# Altium schematic sheet MCU_MSP430F5529IPN.SchDoc
size A4
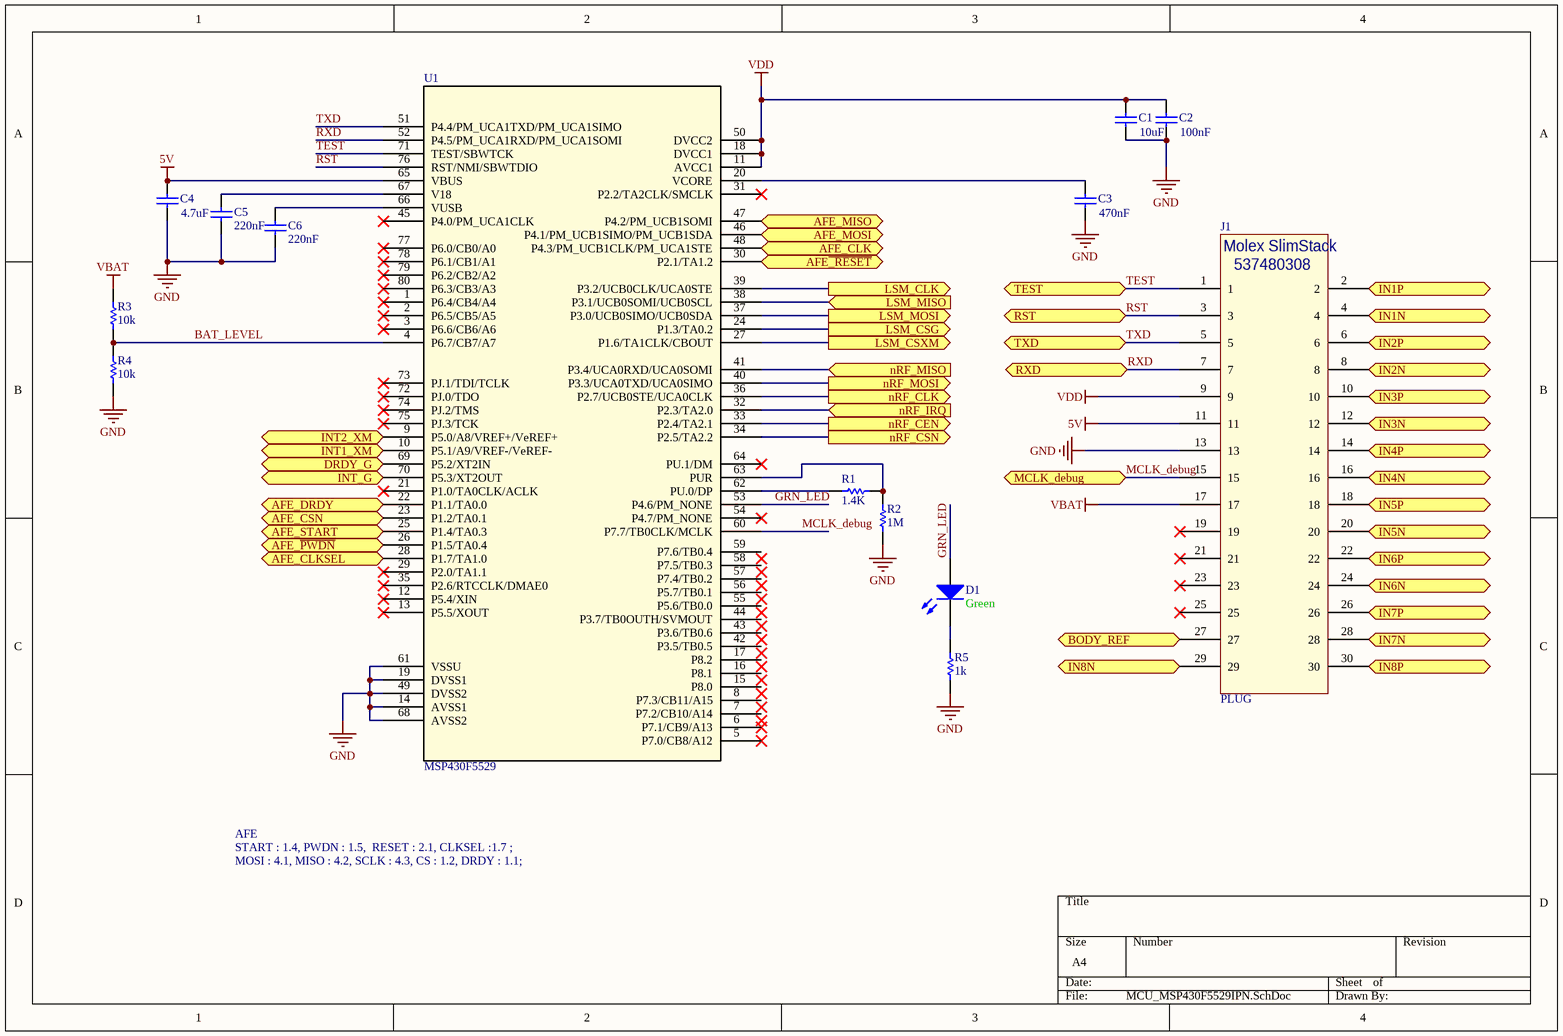
[diagram p0: MCU_MSP430F5529IPN.SchDoc]

## Parts
C1  value 10uF  [0402]  (hidden comment: Cap Semi)
C2  value 100nF  [0402]  (hidden comment: Cap Semi)
C3  value 470nF  [0402]  (hidden comment: Cap Semi)
C4  value 4.7uF  [0402]  (hidden comment: Cap Semi)
C5  value 220nF  [0402]  (hidden comment: Cap Semi)
C6  value 220nF  [0402]  (hidden comment: Cap Semi)
D1  Color: Green  [0402]
J1  PLUG  [Molex 0529910308]
R1  value 1.4K  [0402]
R2  value 1M  [0402]
R3  value 10k  [0402]
R4  value 10k  [0402]
R5  value 1k  [0402]
U1  MSP430F5529  [80-LQFP]

## Ports
AFE_CLK (out), AFE_CLKSEL (out), AFE_CSN (out), AFE_DRDY (in), AFE_MISO (in), AFE_MOSI (out), AFE_START (out), AFE_~{PWDN} (out), AFE~{_RESET} (out), BODY_REF (bidir), DRDY_G (in), IN1N (bidir), IN1P (bidir), IN2N (bidir), IN2P (bidir), IN3N (bidir), IN3P (bidir), IN4N (bidir), IN4P (bidir), IN5N (bidir), IN5P (bidir), IN6N (bidir), IN6P (bidir), IN7N (bidir), IN7P (bidir), IN8N (bidir), IN8P (bidir), INT1_XM (in), INT2_XM (in), INT_G (in), LSM_CLK (out), LSM_CSG (out), LSM_CSXM (out), LSM_MISO (in), LSM_MOSI (out), MCLK_debug (bidir), nRF_CEN (out), nRF_CLK (out), nRF_CSN (out), nRF_IRQ (in), nRF_MISO (in), nRF_MOSI (out), RST (bidir), RXD (bidir), TEST (bidir), TXD (bidir)

## Nets
5V: C4.1 J1.11 U1.65(VBUS)
GND: C1.2 C2.2 C3.2 C4.2 C5.1 C6.1 J1.13 R2.2 R4.1 R5.2 U1.14(AVSS1) U1.19(DVSS1) U1.49(DVSS2) U1.61(VSSU) U1.68(AVSS2)
VBAT: J1.17 R3.2
VDD: C1.1 C2.1 J1.9 U1.11(AVCC1) U1.18(DVCC1) U1.50(DVCC2)
AFE~{_RESET}: U1.30(P2.1/TA1.2) ; port AFE~{_RESET}
AFE_CLK: U1.48(P4.3/PM_UCB1CLK/PM_UCA1STE) ; port AFE_CLK
AFE_CLKSEL: U1.28(P1.7/TA1.0) ; port AFE_CLKSEL
AFE_CSN: U1.23(P1.2/TA0.1) ; port AFE_CSN
AFE_DRDY: U1.22(P1.1/TA0.0) ; port AFE_DRDY
AFE_MISO: U1.47(P4.2/PM_UCB1SOMI) ; port AFE_MISO
AFE_MOSI: U1.46(P4.1/PM_UCB1SIMO/PM_UCB1SDA) ; port AFE_MOSI
AFE_~{PWDN}: U1.26(P1.5/TA0.4) ; port AFE_~{PWDN}
AFE_START: U1.25(P1.4/TA0.3) ; port AFE_START
BAT_LEVEL: R3.1 R4.2 U1.4(P6.7/CB7/A7)
BODY_REF: J1.27 ; port BODY_REF
DRDY_G: U1.69(P5.2/XT2IN) ; port DRDY_G
GRN_LED: D1.1(A) U1.53(P4.6/PM_NONE)
IN1N: J1.4 ; port IN1N
IN1P: J1.2 ; port IN1P
IN2N: J1.8 ; port IN2N
IN2P: J1.6 ; port IN2P
IN3N: J1.12 ; port IN3N
IN3P: J1.10 ; port IN3P
IN4N: J1.16 ; port IN4N
IN4P: J1.14 ; port IN4P
IN5N: J1.20 ; port IN5N
IN5P: J1.18 ; port IN5P
IN6N: J1.24 ; port IN6N
IN6P: J1.22 ; port IN6P
IN7N: J1.28 ; port IN7N
IN7P: J1.26 ; port IN7P
IN8N: J1.29 ; port IN8N
IN8P: J1.30 ; port IN8P
INT1_XM: U1.10(P5.1/A9/VREF-/VeREF-) ; port INT1_XM
INT2_XM: U1.9(P5.0/A8/VREF+/VeREF+) ; port INT2_XM
INT_G: U1.70(P5.3/XT2OUT) ; port INT_G
LSM_CLK: U1.39(P3.2/UCB0CLK/UCA0STE) ; port LSM_CLK
LSM_CSG: U1.24(P1.3/TA0.2) ; port LSM_CSG
LSM_CSXM: U1.27(P1.6/TA1CLK/CBOUT) ; port LSM_CSXM
LSM_MISO: U1.38(P3.1/UCB0SOMI/UCB0SCL) ; port LSM_MISO
LSM_MOSI: U1.37(P3.0/UCB0SIMO/UCB0SDA) ; port LSM_MOSI
MCLK_debug: J1.15 U1.60(P7.7/TB0CLK/MCLK) ; port MCLK_debug
nRF_CEN: U1.33(P2.4/TA2.1) ; port nRF_CEN
nRF_CLK: U1.36(P2.7/UCB0STE/UCA0CLK) ; port nRF_CLK
nRF_CSN: U1.34(P2.5/TA2.2) ; port nRF_CSN
nRF_IRQ: U1.32(P2.3/TA2.0) ; port nRF_IRQ
nRF_MISO: U1.41(P3.4/UCA0RXD/UCA0SOMI) ; port nRF_MISO
nRF_MOSI: U1.40(P3.3/UCA0TXD/UCA0SIMO) ; port nRF_MOSI
RST: J1.3 U1.76(RST/NMI/SBWTDIO) ; port RST
RXD: J1.7 U1.52(P4.5/PM_UCA1RXD/PM_UCA1SOMI) ; port RXD
TEST: J1.1 U1.71(TEST/SBWTCK) ; port TEST
TXD: J1.5 U1.51(P4.4/PM_UCA1TXD/PM_UCA1SIMO) ; port TXD
NetC3_1: C3.1 U1.20(VCORE)
NetC5_2: C5.2 U1.67(V18)
NetC6_2: C6.2 U1.66(VUSB)
NetD1_2: D1.2(K) R5.1
NetR1_1: R1.1 R2.1 U1.63(PUR)
NetR1_2: R1.2 U1.62(PU.0/DP)

Not connected (* = marked no-connect by the designer): J1 19* 21* 23* 25*; U1 1(P6.4/CB4/A4)* 2(P6.5/CB5/A5)* 3(P6.6/CB6/A6)* 5(P7.0/CB8/A12)* 6(P7.1/CB9/A13)* 7(P7.2/CB10/A14) 8(P7.3/CB11/A15) 12(P5.4/XIN)* 13(P5.5/XOUT)* 15(P8.0) 16(P8.1) 17(P8.2) 21(P1.0/TA0CLK/ACLK)* 29(P2.0/TA1.1)* 31(P2.2/TA2CLK/SMCLK)* 35(P2.6/RTCCLK/DMAE0)* 42(P3.5/TB0.5) 43(P3.6/TB0.6) 44(P3.7/TB0OUTH/SVMOUT) 45(P4.0/PM_UCA1CLK)* 54(P4.7/PM_NONE)* 55(P5.6/TB0.0) 56(P5.7/TB0.1) 57(P7.4/TB0.2) 58(P7.5/TB0.3) 59(P7.6/TB0.4) 64(PU.1/DM)* 72(PJ.0/TDO)* 73(PJ.1/TDI/TCLK)* 74(PJ.2/TMS)* 75(PJ.3/TCK)* 77(P6.0/CB0/A0)* 78(P6.1/CB1/A1)* 79(P6.2/CB2/A2)* 80(P6.3/CB3/A3)*

## Notes on the sheet
- AFE
- START : 1.4, PWDN : 1.5,  RESET : 2.1, CLKSEL :1.7 ;
- MOSI : 4.1, MISO : 4.2, SCLK : 4.3, CS : 1.2, DRDY : 1.1;
- (in symbol Molex 529910308) Molex SlimStack; 537480308

## Library data of the parts
C1-C6 = Cap Semi: Capacitor (Semiconductor SIM Model); Published: 8-Jun-2000; LatestRevisionDate: 29-May-2009; LatestRevisionNote: IPC-7351 Footprint Added.; PackageReference: C1206; Publisher: Altium Limited; PackageDescription: Chip Capacitor; Supplier 1: Digi-Key
  C1 C2: Supplier Part Number 1: 490-10692-2-ND
  C3: Supplier Part Number 1: 1276-1734-2-ND
  C4: Supplier Part Number 1: 490-5915-2-ND
  C5 C6: Supplier Part Number 1: 490-3884-2-ND
D1 = LED3: Typical BLUE SiC LED; Published: 8-Jun-2000; LatestRevisionDate: 17-Dec-2003; LatestRevisionNote: PCB Footprint replaced.; DatasheetVersion: 16-Apr-2002; PackageVersion: 16-Apr-2002; PackageReference: 3.5X2.8X1.9; Publisher: Altium Limited; PackageDescription: SM LED; 2 C-Bend Leads; Body 3.5 x 2.8 x 1.9 mm, inc leads (LxWxH typ)
J1 = Molex 529910308
R1-R5 = Res Semi: Semiconductor Resistor; Published: 8-Jun-2000; LatestRevisionDate: 17-Jul-2002; LatestRevisionNote: Re-released for DXP Platform.; PackageReference: AXIAL-0.5; Publisher: Altium Limited; PackageDescription: Axial Device, Thru-Hole; 2 Leads; 0.5 in Pin Spacing; Supplier 1: Digi-Key
  R1 R3 R4: Supplier Part Number 1: RHM1.4KBHTR-ND
  R2: Supplier Part Number 1: RHM1.00MCDTR-ND
  R5: Supplier Part Number 1: RHM100CDTR-ND
U1 = MSP430F5529: IC MCU 16BIT 128KB FLASH 80LQFP; Supplier 1: Digi-Key; Supplier Part Number 1: 296-25427-ND